# EAGLE design Cricket (EAGLE 7.2.0)
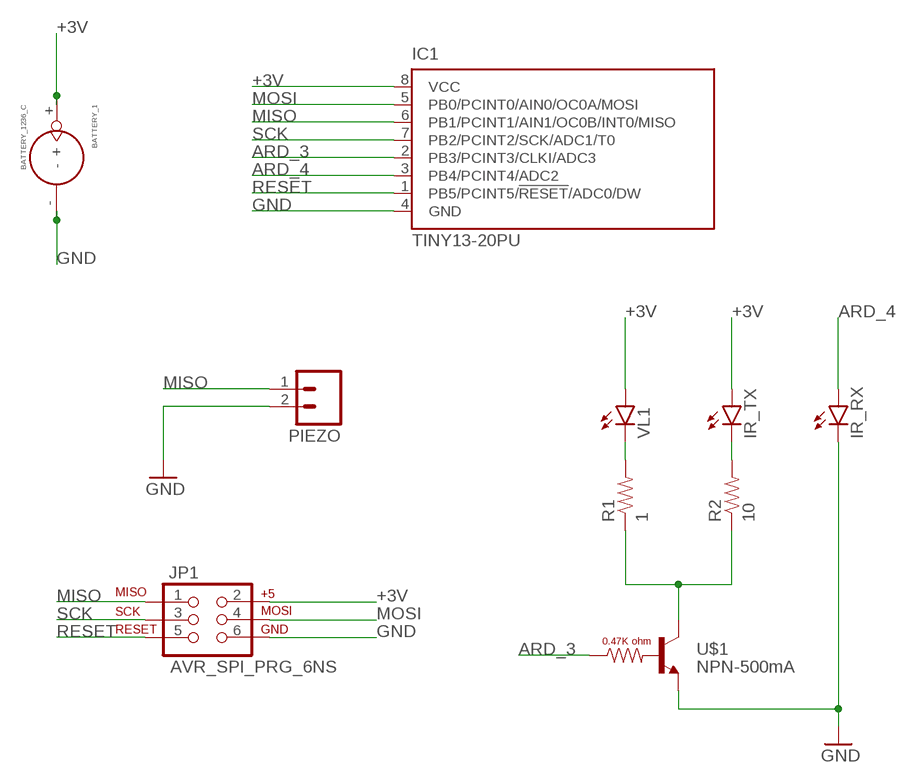
[diagram p0: schematic, sheet 1]

## Parts
BATTERY_1  BATTERY_1236_C  [BATTERY_1236_C]
IC1  TINY13-20PU  [DIL08]
IR_RX  LED5MM  [LED5MM]
IR_TX  LED5MM  [LED5MM]
JP1  AVR_SPI_PRG_6NS  [2X3-NS]
PIEZO  M02PTH  [1X02]
R1  1  RESISTOR1206  [1206]
R2  10  RESISTOR1206  [1206]
U$1  NPN-500mA  TRANSISTOR-NPN-DDTD142TC  [SOT23-3]
VL1  LED5MM  [LED5MM]

## Nets
+3V: BATTERY_1.+ IC1.8(VCC) IR_TX.A JP1.2 VL1.A
ARD_3: IC1.2(PB3/PCINT3/CLKI/ADC3) U$1.1(B)
ARD_4: IC1.3(PB4/PCINT4/ADC2) IR_RX.A
GND: BATTERY_1.- IC1.4(GND) IR_RX.K(C) JP1.6 PIEZO.2 U$1.2(E)
MISO: IC1.6(PB1/PCINT1/AIN1/OC0B/INT0/MISO) JP1.1 PIEZO.1
MOSI: IC1.5(PB0/PCINT0/AIN0/OC0A/MOSI) JP1.4
N$1: R1.2 VL1.K(C)
N$2: IR_TX.K(C) R2.2
N$3: R1.1 R2.1 U$1.3(C)
RESET: IC1.1(PB5/PCINT5/!RESET!/ADC0/DW) JP1.5
SCK: IC1.7(PB2/PCINT2/SCK/ADC1/T0) JP1.3

## Library data of the parts
BATTERY_1 = Itead_BP_110825.lbr:BATTERY_1236_C: SOC004
IC1 = atmel:TINY13: 8-bit AVR Microcontroller with 1K Bytes In-System Programmable Flash Source: http://www.atmel.com/dyn/resources/prod_documents/2535S.pdf; MPN: ATTINY13-20PU; OC_FARNELL: 9171550; OC_NEWARK: 96K6521
IR_RX = SparkFun-LED:LED: LEDs Standard schematic elements and footprints for 5mm, 3mm, 1206, and 0603 sized LEDs. 5mm - Spark Fun Electronics SKU : COM-00529 (and others); MFG: OSRAM Opto; MPN: SFH206K
IR_TX VL1 = SparkFun-LED:LED: LEDs Standard schematic elements and footprints for 5mm, 3mm, 1206, and 0603 sized LEDs. 5mm - Spark Fun Electronics SKU : COM-00529 (and others); MFG: TT Electronics / Optek Technology; MPN: OP293B
JP1 = SparkFun-Connectors:AVR_SPI_PRG_6: AVR ISP 6 Pin This is the reduced ISP connector for AVR programming. Common on Arduino. This footprint will take up less PCB space and can be used with a 10-pin to 6-pin adapter such as SKU: BOB-08508 **Special note about "TEST_POINT" package. The stop mask is on the top side, so if you want your programming test points to be on the bottom of your board, make sure to place this package on the bottom side of the board. This also ensure that the orientation to program from the bottom side will be correct.
PIEZO = SparkFun-Connectors:M02: Standard 2-pin 0.1" header. Use with - straight break away headers ( PRT-00116) - right angle break away headers (PRT-00553) - swiss pins (PRT-00743) - machine pins (PRT-00117) - female headers (PRT-00115) Molex polarized connector foot print use with: PRT-08233 with associated crimp pins and housings. 2.54_SCREWTERM for use with PRT-10571. 3.5mm Screw Terminal footprints for PRT-08084 5mm Screw Terminal footprints for use with PRT-08432
R1 R2 = SparkFun-Resistors:RESISTOR: Resistor Basic schematic elements and footprints for 0603, 1206, and PTH resistors.
U$1 = SparkFun-DiscreteSemi:TRANSISTOR-NPN-DDTD142TC: NPN transistor with built in base resistor.; PROD_ID: TRANS-11480

## Board
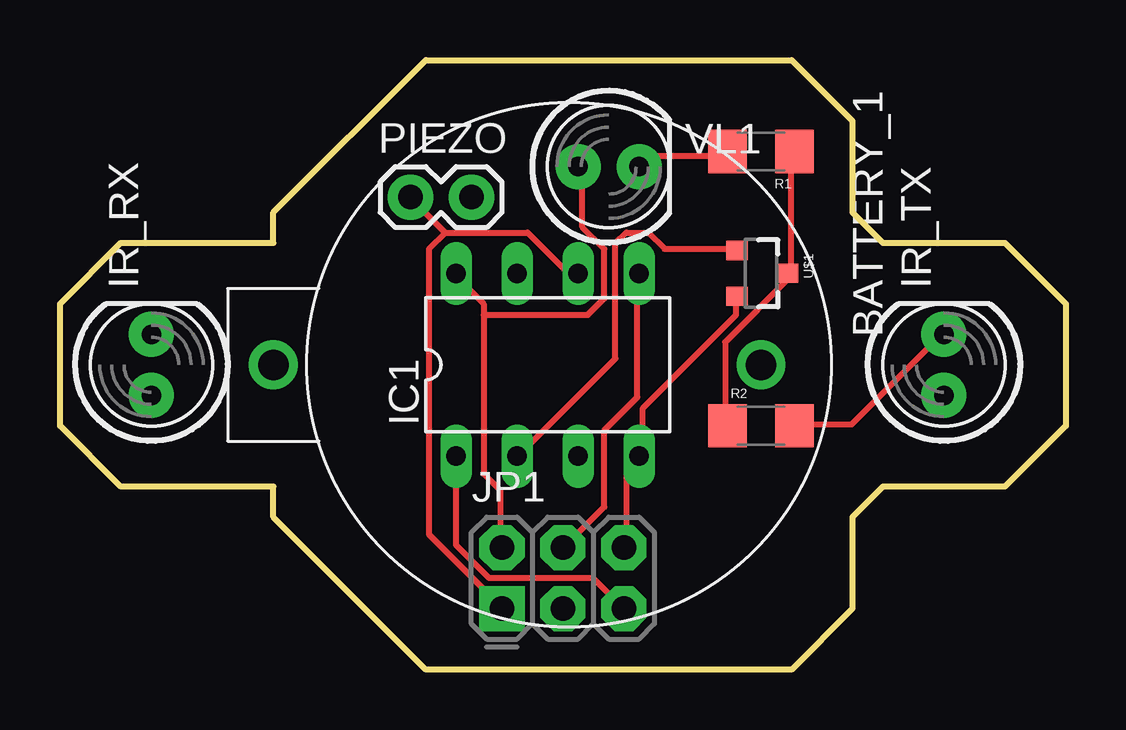
[diagram p1: board, top side]
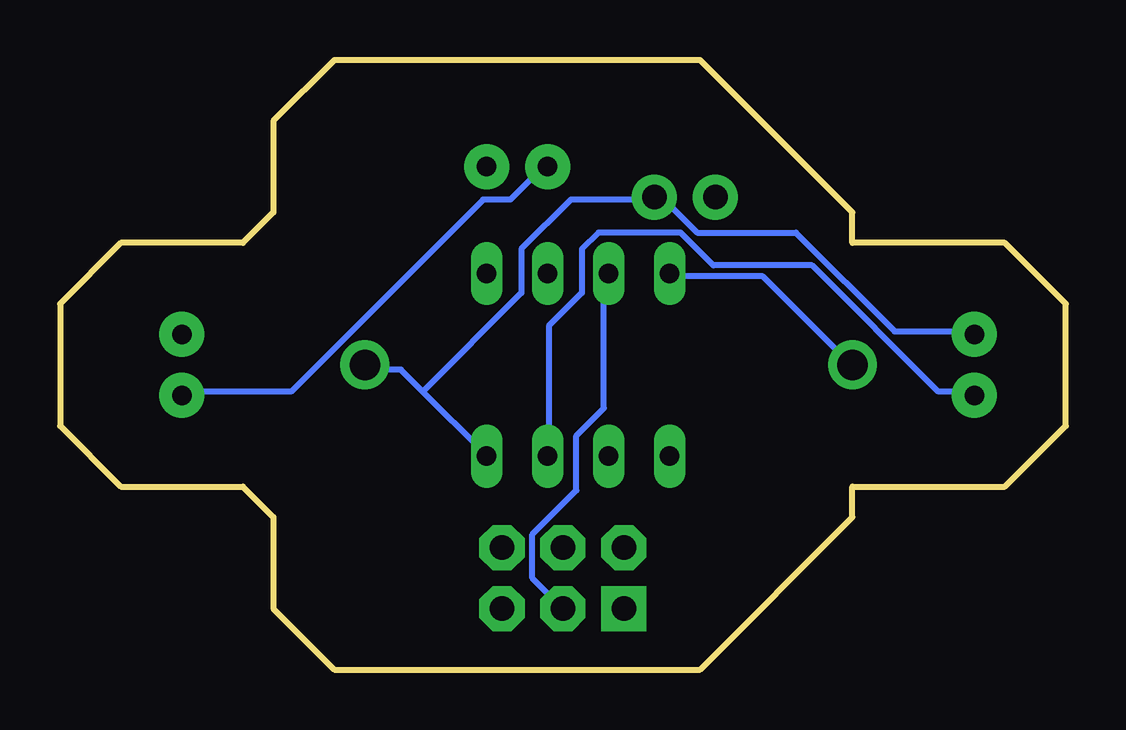
[diagram p2: board, bottom side, seen from below]

Size 41.91 x 25.4 mm. Coordinates in mm from the lower left corner, seen from the top.
Outline: 2.54,17.78 8.89,17.78 8.89,19.05 15.24,25.4 30.48,25.4 33.02,22.86 33.02,19.05 34.29,17.78 39.37,17.78 41.91,15.24 41.91,10.16 39.37,7.62 34.29,7.62 33.02,6.35 33.02,2.54 30.48,0 15.24,0 8.89,6.35 8.89,7.62 2.54,7.62 0,10.16 0,15.24 2.54,17.78
Copper layers (1*16): Top 0.035mm / dielectric 1.5mm / Bottom 0.035mm
Design rules "default": minimum track width 10mil, minimum drill 24mil, track to track 8mil, track to pad 8mil, pad to pad 8mil, via to via 8mil, smd to smd 8mil, copper to edge 40mil, drill to drill 8mil, minimum pad ring 10mil, minimum via ring 8mil, stop-mask expansion 4mil, vias tented up to drill 0mil, thermal gap 10mil

### Footprints (pad centres in the part's own frame; a part is rotated, then mirrored left to right if it is on the bottom)
BATTERY_1236_C = drill 1.27 pad 2.032: + 0,0; - 0,20.32
DIL08 = drill 0.813 long: 1 -3.81,-3.81; 2 -1.27,-3.81; 3 1.27,-3.81; 4 3.81,-3.81; 5 3.81,3.81; 6 1.27,3.81; 7 -1.27,3.81; 8 -3.81,3.81
LED5MM = drill 0.813 pad 1.88: A -1.27,0; K 1.27,0
2X3-NS = drill 1.016 pad 1.88 square: 1 -2.54,-1.27 | drill 1.016 pad 1.88 octagon: 2 -2.54,1.27; 3 0,-1.27; 4 0,1.27; 5 2.54,-1.27; 6 2.54,1.27
1X02 = drill 1.016 pad 1.88: 1 0,0; 2 2.54,0
1206 = smd 1.6 x 1.8: 1 -1.4,0; 2 1.4,0
SOT23-3 = smd 0.8 x 0.9: 1 -0.95,-1; 2 0.95,-1; 3 0,1.1

### Placement (x,y rotation side)
BATTERY_1  8.89,12.7 270 top
IC1  20.32,12.7 0 top
IR_RX  3.81,12.7 90 top
IR_TX  36.83,12.7 90 top
JP1  20.95,3.81 0 top
PIEZO  14.6,19.68 0 top
R1  29.21,21.59 180 top
R2  29.21,10.16 0 top
U$1  29.21,16.51 270 top
VL1  22.86,20.96 0 top

### Tracks (layer width: path | path; a pad name or v marks a point on that pad's centre or on a via)
+3V
  Top 0.254: 17.65,14.78 17.65,15.24 16.51,16.38 IC1.8 | 17.65,14.78 17.65,8.15 18.34,7.47 18.34,5.18 JP1.2 | 17.65,14.78 22,14.78 22.68,15.47 22.68,17.53 21.77,18.44 21.77,20.96 VL1.A
  Bottom 0.254: IC1.8 16.51,16.38 12.62,16.38 8.97,12.72 BATTERY_1.+ | IR_TX.A 36.63,11.58 32.28,11.58 24.28,19.58 23.14,19.58 21.77,20.96 VL1.A
ARD_3
  Top 0.254: U$1.1 28.17,17.53 25.2,17.53 24.51,18.21 23.6,18.21 23.14,17.75 23.14,12.95 19.25,9.07 IC1.2
ARD_4
  Bottom 0.254: IC1.3 21.54,9.07 21.54,14.33 20.17,15.7 20.17,17.53 19.48,18.21 16.05,18.21 14.68,16.84 10.57,16.84 5.31,11.58 3.94,11.58 IR_RX.A
GND
  Top 0.254: U$1.2 28.17,15.47 28.17,14.78 24.28,10.9 24.28,9.07 IC1.4 24.05,8.84 23.6,8.38 23.6,5.18 JP1.6
  Bottom 0.254: 26.8,11.58 24.28,9.07 IC1.4 | 26.8,11.58 27.71,12.5 29.08,12.5 BATTERY_1.- | IR_RX.K 3.94,14.1 7.14,14.1 11.25,18.21 15.37,18.21 16.97,19.81 PIEZO.2 17.2,19.58 20.62,19.58 22.68,17.53 22.68,15.7 26.8,11.58
MISO
  Top 0.254: 16.05,18.21 19.48,18.21 21.08,16.61 21.54,16.61 IC1.6 | 16.05,18.21 14.68,19.58 PIEZO.1 | 16.05,18.21 15.37,17.53 15.37,5.64 18.34,2.67 JP1.1
MOSI
  Top 0.254: IC1.5 24.05,16.38 24.05,11.35 22.68,9.98 22.68,6.78 21.08,5.18 JP1.4
N$1
  Top 0.254: R1.2 27.71,21.41 24.74,21.41 24.28,20.96 VL1.K
N$2
  Top 0.254: R2.2 30.68,10.21 32.97,10.21 36.63,13.87 IR_TX.K
N$3
  Top 0.254: R1.1 30.45,21.41 30.45,16.61 U$1.3 30.45,16.38 27.71,13.64 27.71,10.21 R2.1
RESET
  Top 0.254: IC1.1 16.51,5.18 17.88,3.81 22.23,3.81 JP1.5
SCK
  Bottom 0.254: JP1.3 22.23,3.81 22.23,5.64 20.4,7.47 20.4,9.75 19.25,10.9 19.25,16.38 IC1.7